# Altium schematic sheet SD Card.SchDoc
size A4
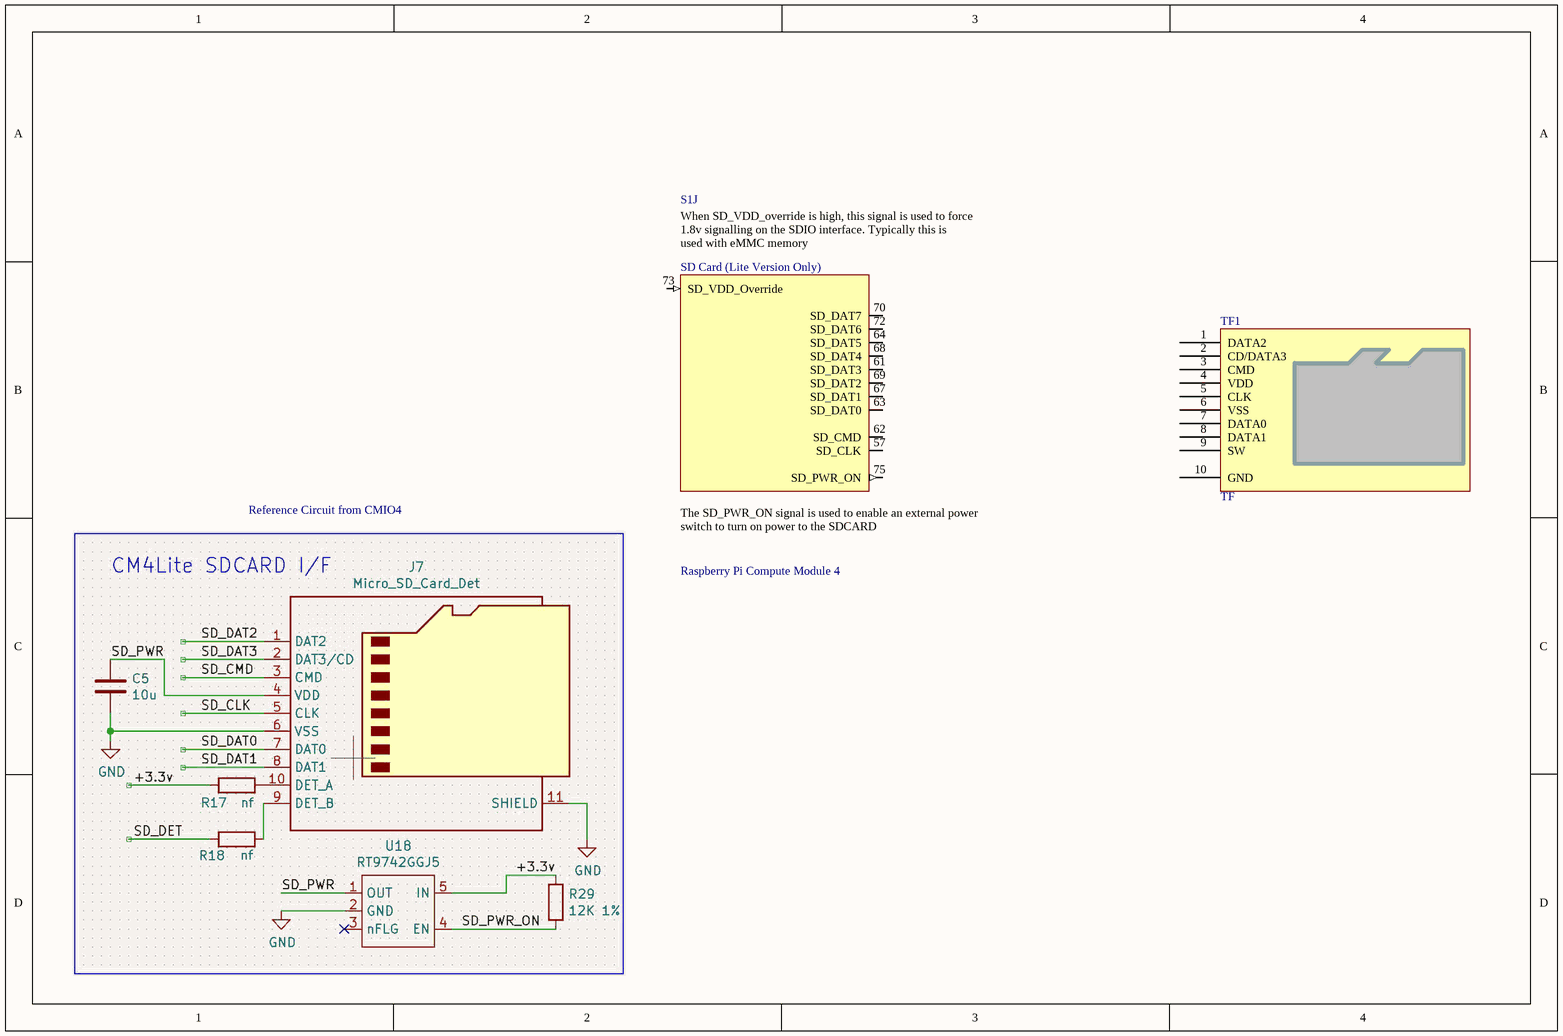
[diagram p0: SD Card.SchDoc]

## Parts
S1  Raspberry Pi Compute Module 4  [CM4-F40C-100DS-0.4v_1.5mm_0mm]  (part J of 21)
TF1  TF  [TF-SOCKET]

## Nets

Not connected (* = marked no-connect by the designer): S1 57(SD_CLK) 61(SD_DAT3) 62(SD_CMD) 63(SD_DAT0) 64(SD_DAT5) 67(SD_DAT1) 68(SD_DAT4) 69(SD_DAT2) 70(SD_DAT7) 72(SD_DAT6) 73(SD_VDD_Override) 75(SD_PWR_ON); TF1 1(DATA2) 2(CD/DATA3) 3(CMD) 4(VDD) 5(CLK) 6(VSS) 7(DATA0) 8(DATA1) 9(SW) 10(GND)

## Notes on the sheet
- Reference Circuit from CMIO4
- Title
- Size:
- Date:
- A4
- Number:
- Time:
- Revision:
- Sheet
- of
- Q-Wave Systems Co.,Ltd
- 65/2 Moo 1 Beung
- Sriracha Chonburi
- Thailand
- File:
- (in symbol CM4, part J) When SD_VDD_override is high, this signal is used to force 1.8v signalling on the SDIO interface. Typically this is / used with eMMC memory; SD Card (Lite Version Only); by Amornthep Phunsin; The SD_PWR_ON signal is used to enable an external power switch to turn on power to the SDCARD

## Library data of the parts
S1 = CM4: Raspberry Pi Compute Module 4 by Amornthep Phunsin
TF1 = TF卡座: 8脚自弹